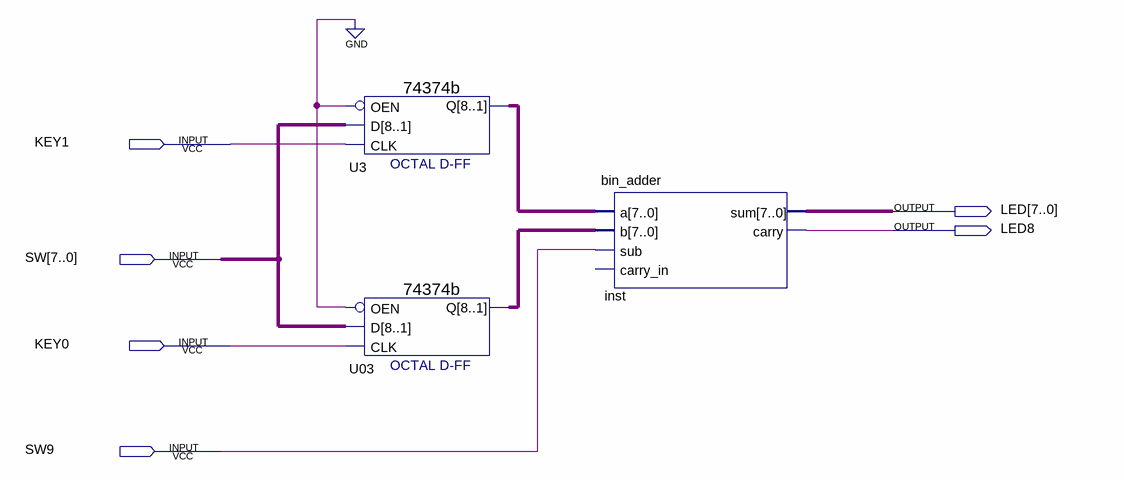
[diagram p0: schematic sheet]
// Quartus schematic BinaryAddSub.bdf as structural Verilog: 3 symbols, 6 pins
module BinaryAddSub (
  input  KEY1,
  input  [7:0] SW,
  input  KEY0,
  input  SW9,
  output [7:0] LED,
  output LED8
);

  wire [7:0] U3_q, U03_q;

  \74374b  U3 (.D(SW), .OEN(1'b0), .CLK(KEY1), .Q(U3_q));
  \74374b  U03 (.D(SW), .OEN(1'b0), .CLK(KEY0), .Q(U03_q));
  bin_adder inst (.a(U3_q), .b(U03_q), .sub(SW9), .sum(LED), .carry(LED8));  // open: carry_in
endmodule
